# EAGLE schematic 9.1.2_test_circuits (EAGLE 9.6.2)
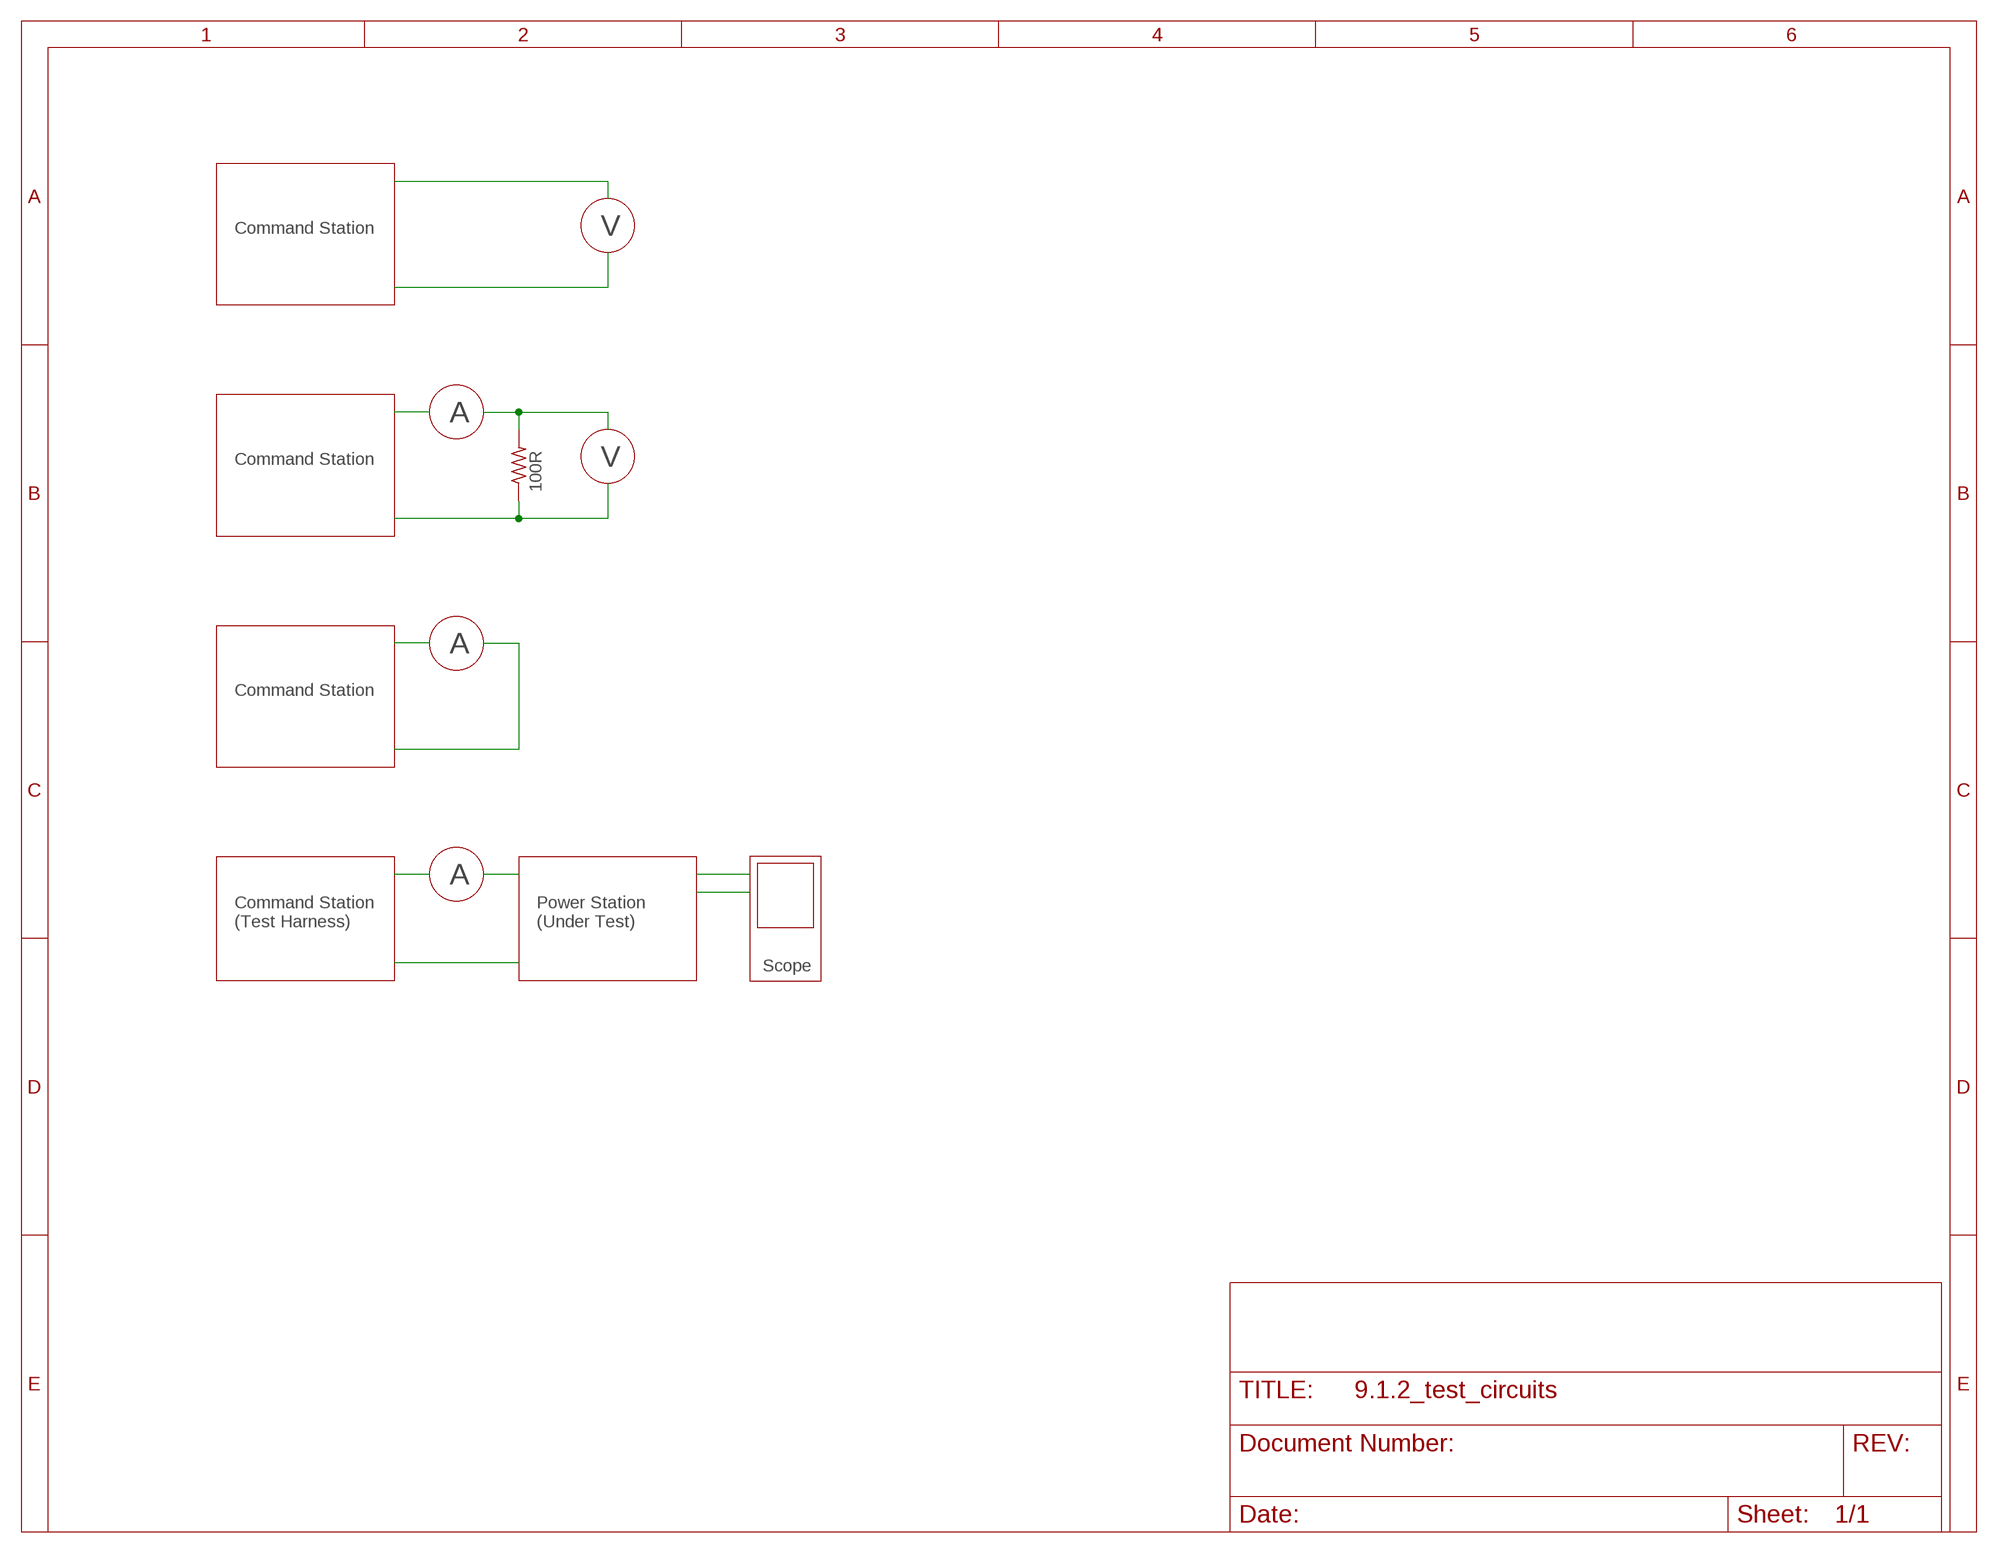
[diagram p0: schematic, sheet 1]

## Parts
R2  100R  R-US_R1206  [R1206]

## Nets
N$5: R2.2
N$6: R2.1

## Notes on the sheet
- Command Station | V
- A
- Command Station | V
- A
- Command Station
- A
- Command Station
  (Test Harness)
- Power Station
  (Under Test)
- Scope

## Library data of the parts
R2 = rcl:R-US_: RESISTOR, American symbol; SPICEPREFIX: R